# EAGLE design uNav4x4r1 (EAGLE 6.5.0)
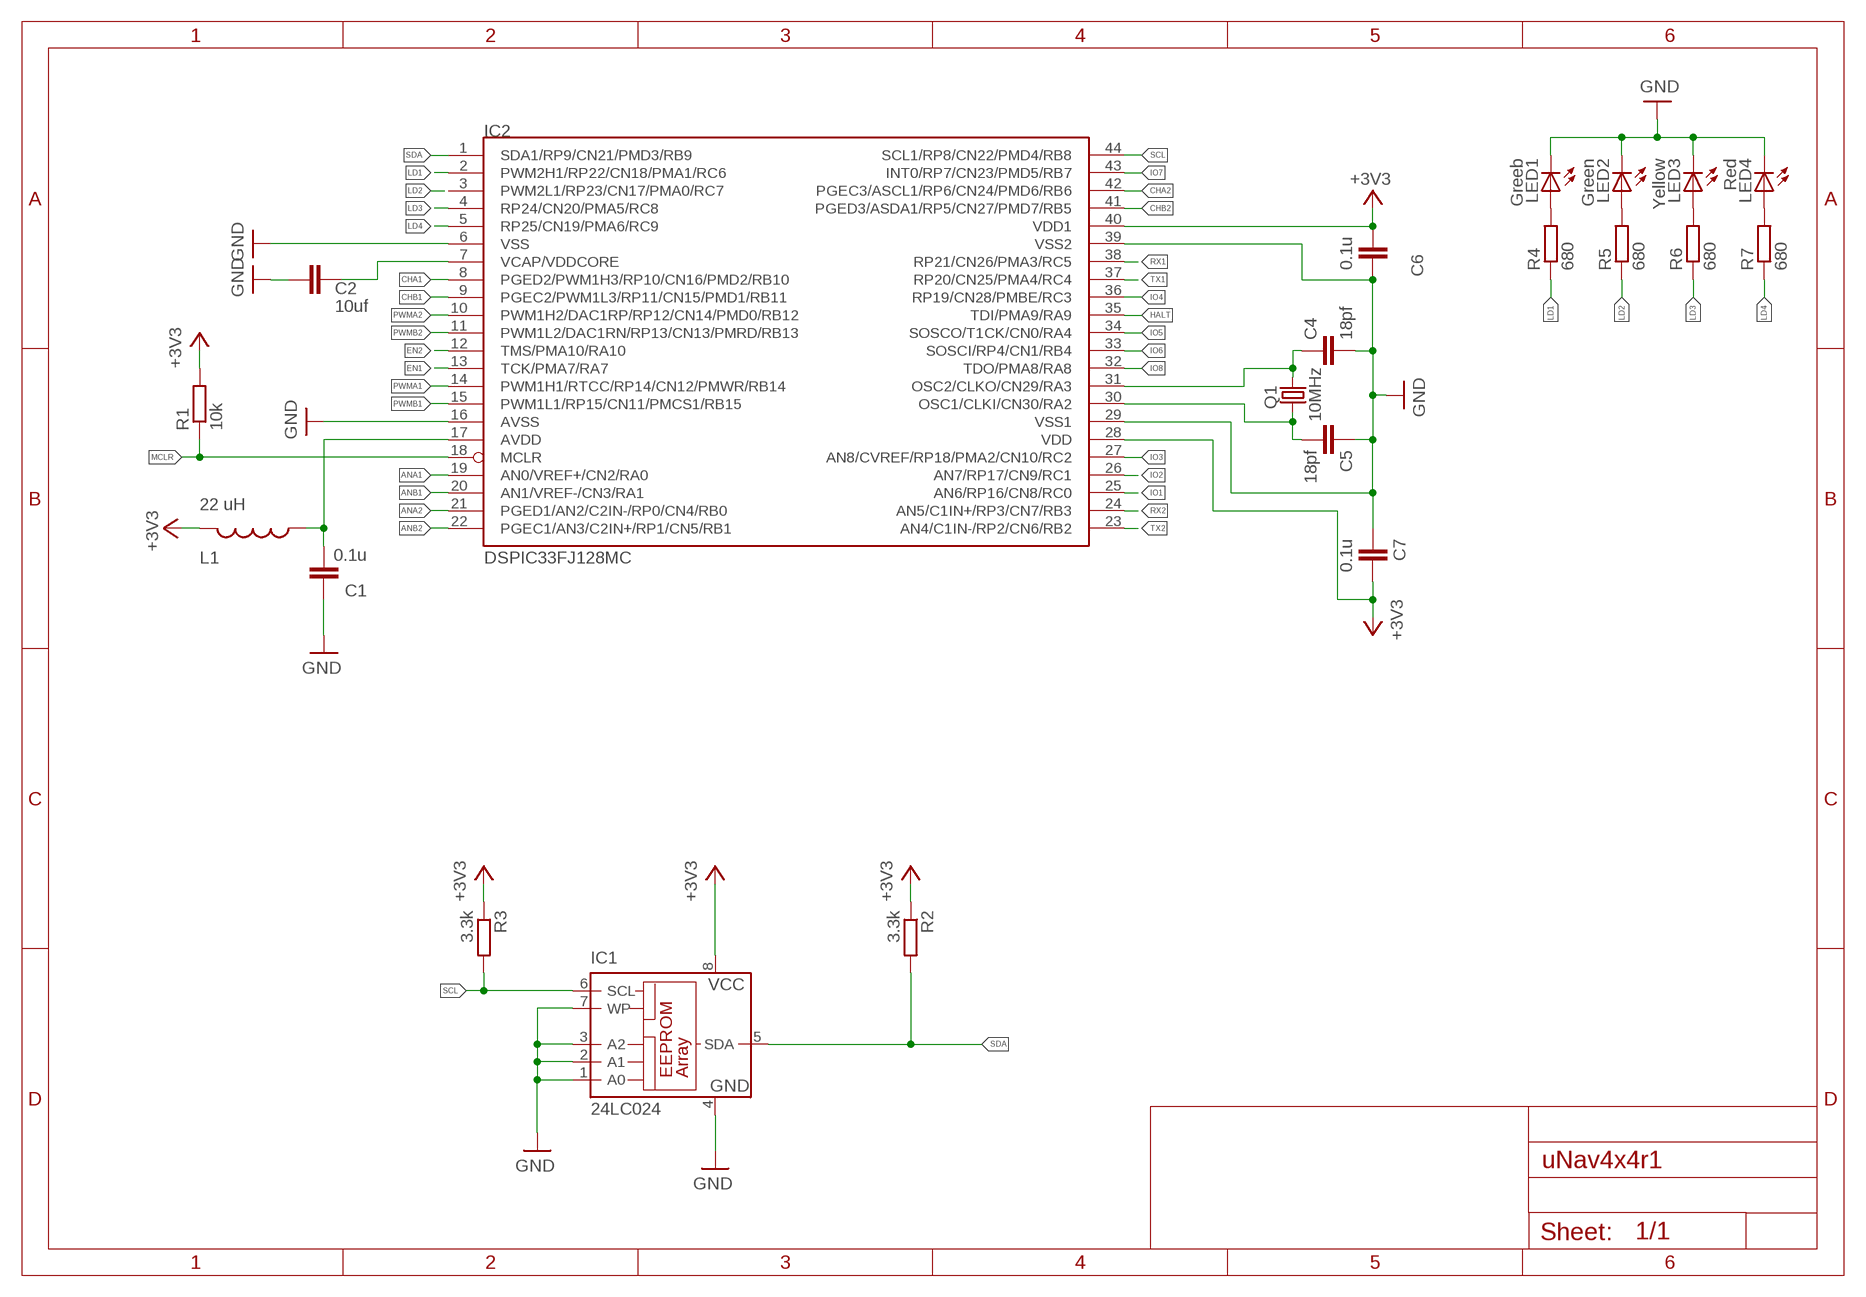
[diagram p0: schematic, sheet 1, part 1 of 2]
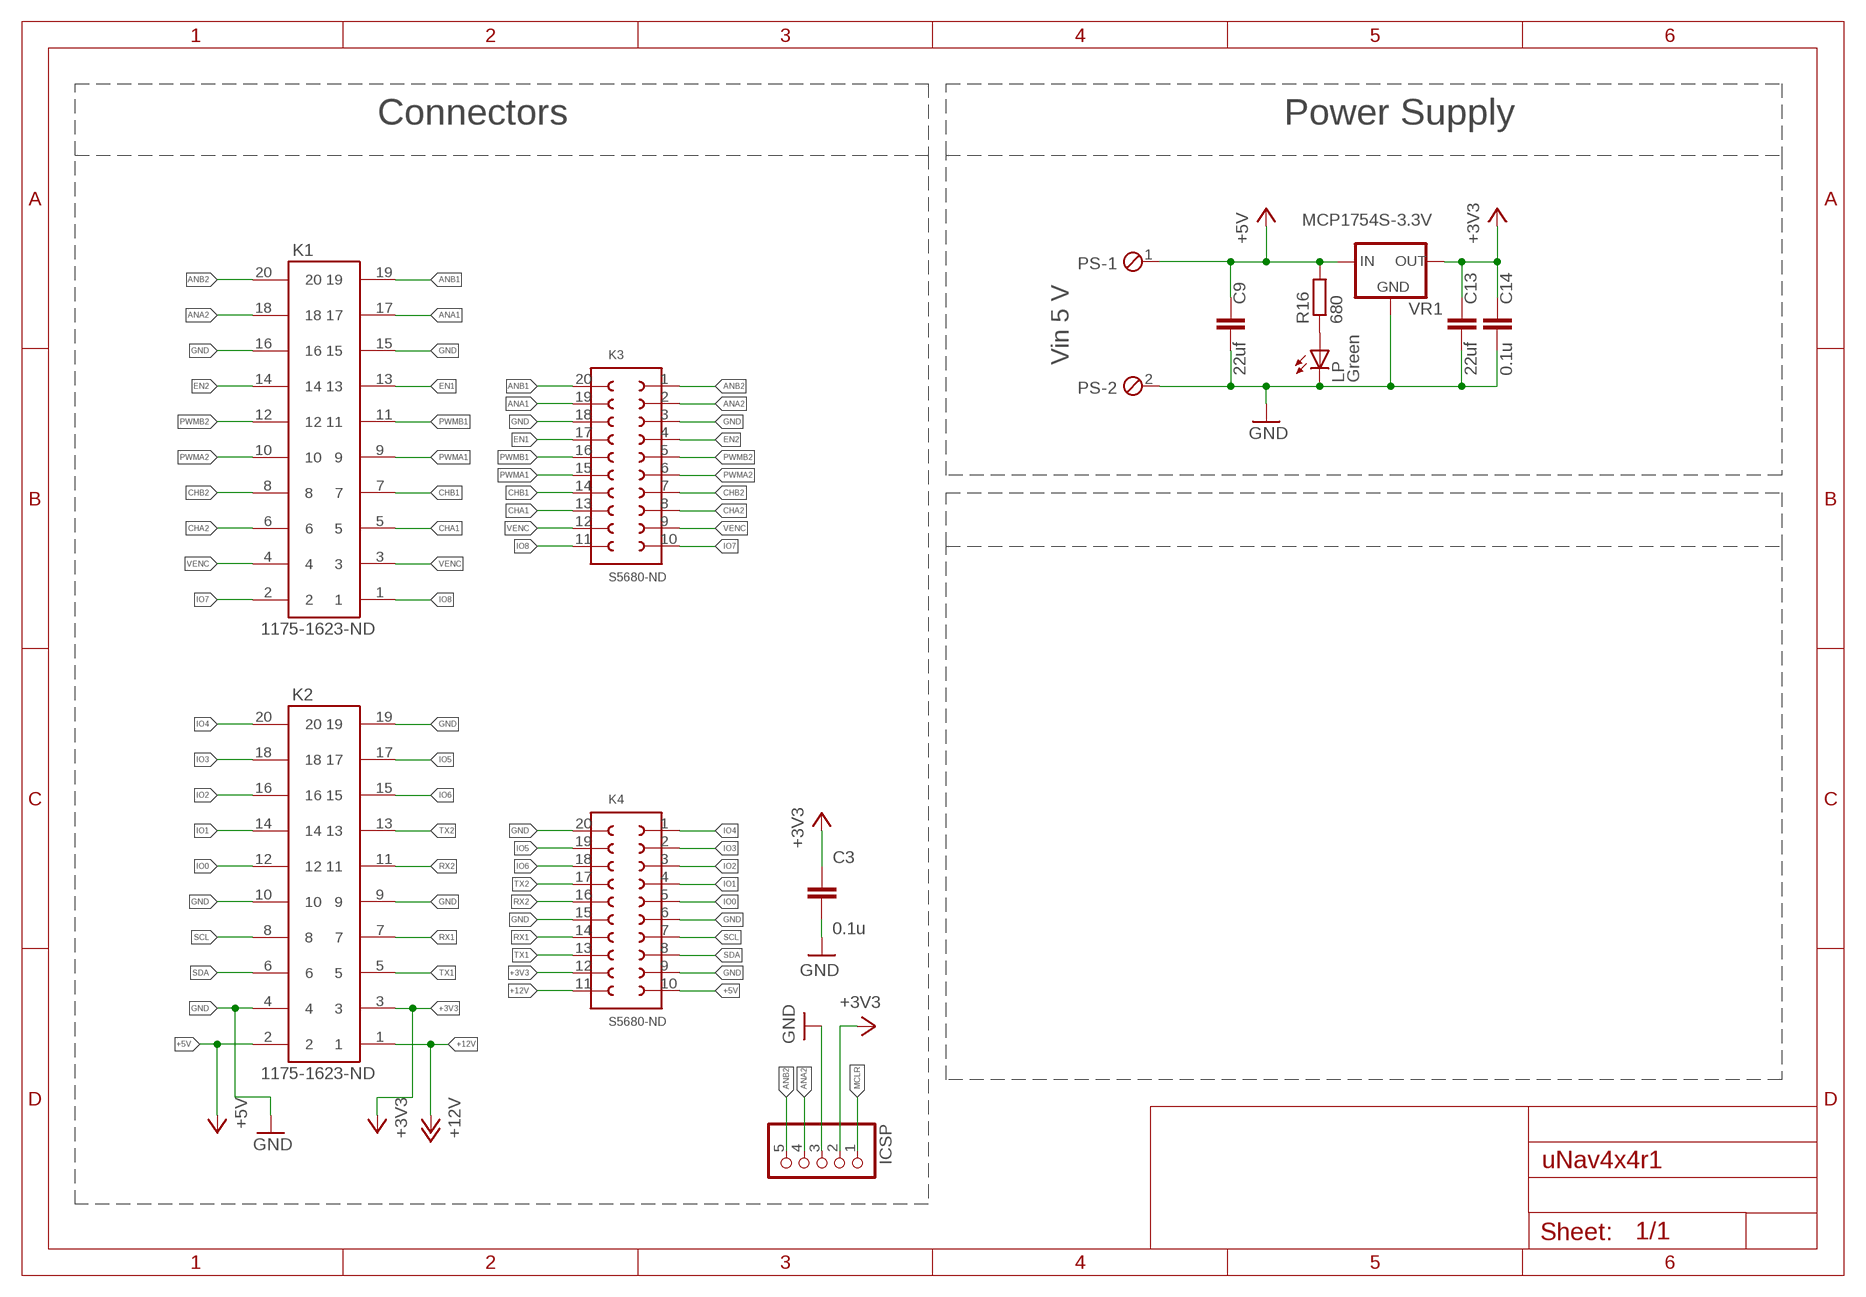
[diagram p1: schematic, sheet 1, part 2 of 2]

## Parts
C1  0.1u  C-EUC0603  [C0603]
C2  10uf  C-EUC1206  [C1206]
C3  0.1u  C-EUC0603  [C0603]
C4  18pf  C-EUC0603  [C0603]
C5  18pf  C-EUC0603  [C0603]
C6  0.1u  C-EUC0603  [C0603]
C7  0.1u  C-EUC0603  [C0603]
C9  22uf  C-EUC1206  [C1206]
C13  22uf  C-EUC1206  [C1206]
C14  0.1u  C-EUC0603  [C0603]
IC1  24LC024  24AA01SM  [SO-08M]
IC2  DSPIC33FJ128MC  DSPIC33FJ128MC804-PT  [TQFP44]
ICSP  PINHD-1X05_2.54-S  [1X05-S]
K1  1175-1623-ND  612X2020621  [612X2020621]
K2  1175-1623-ND  612X2020621  [612X2020621]
K3  S5680-ND  61002021821  [61002021821]
K4  S5680-ND  61002021821  [61002021821]
L1  22 uH  INDUCTOR0805  [0805]
LED1  Greeb  LEDCHIPLED_0805  [CHIPLED_0805]
LED2  Green  LEDCHIPLED_0805  [CHIPLED_0805]
LED3  Yellow  LEDCHIPLED_0805  [CHIPLED_0805]
LED4  Red  LEDCHIPLED_0805  [CHIPLED_0805]
LP  Green  LEDCHIPLED_0805  [CHIPLED_0805]
PS  MPT2  [2POL254]
Q1  10MHz  CRYSTALHC49U-V  [HC49U-V]
R1  10k  R-EU_R0603  [R0603]
R2  3.3k  R-EU_R0603  [R0603]
R3  3.3k  R-EU_R0603  [R0603]
R4  680  R-EU_R0603  [R0603]
R5  680  R-EU_R0603  [R0603]
R6  680  R-EU_R0603  [R0603]
R7  680  R-EU_R0603  [R0603]
R16  680  R-EU_R0603  [R0603]
VR1  MCP1754S-3.3V  MCP1754S  [SOT89]

## Nets
+3V3: C3.1 C6.2 C7.1 C13.1 C14.1 IC1.8(VCC) IC2.28(VDD) IC2.40(VDD1) ICSP.2 K2.3 K4.12 L1.2 R1.2 R2.1 R3.1 VR1.3(OUT)
+5V: C9.1 K2.2 K4.10 PS.1 R16.2 VR1.1(IN)
+12V: K2.1 K4.11
ANA1: IC2.19(AN0/VREF+/CN2/RA0) K1.17 K3.19
ANA2: IC2.21(PGED1/AN2/C2IN-/RP0/CN4/RB0) ICSP.4 K1.18 K3.2
ANB1: IC2.20(AN1/VREF-/CN3/RA1) K1.19 K3.20
ANB2: IC2.22(PGEC1/AN3/C2IN+/RP1/CN5/RB1) ICSP.5 K1.20 K3.1
AVDD: C1.2 IC2.17(AVDD) L1.1
CHA1: IC2.8(PGED2/PWM1H3/RP10/CN16/PMD2/RB10) K1.5 K3.13
CHA2: IC2.42(PGEC3/ASCL1/RP6/CN24/PMD6/RB6) K1.6 K3.8
CHB1: IC2.9(PGEC2/PWM1L3/RP11/CN15/PMD1/RB11) K1.7 K3.14
CHB2: IC2.41(PGED3/ASDA1/RP5/CN27/PMD7/RB5) K1.8 K3.7
EN1: IC2.13(TCK/PMA7/RA7) K1.13 K3.17
EN2: IC2.12(TMS/PMA10/RA10) K1.14 K3.4
GND: C1.1 C2.2 C3.2 C4.2 C5.1 C6.1 C7.2 C9.2 C13.2 C14.2 IC1.1(A0) IC1.2(A1) IC1.3(A2) IC1.4(GND) IC1.7(WP) IC2.6(VSS) IC2.16(AVSS) IC2.29(VSS1) IC2.39(VSS2) ICSP.3 K1.15 K1.16 K2.4 K2.9 K2.10 K2.19 K3.3 K3.18 K4.6 K4.9 K4.15 K4.20 LED1.C LED2.C LED3.C LED4.C LP.C PS.2 VR1.2(GND) VR1.4(GND)
HALT: IC2.35(TDI/PMA9/RA9)
IO0: K2.12 K4.5
IO1: IC2.25(AN6/RP16/CN8/RC0) K2.14 K4.4
IO2: IC2.26(AN7/RP17/CN9/RC1) K2.16 K4.3
IO3: IC2.27(AN8/CVREF/RP18/PMA2/CN10/RC2) K2.18 K4.2
IO4: IC2.36(RP19/CN28/PMBE/RC3) K2.20 K4.1
IO5: IC2.34(SOSCO/T1CK/CN0/RA4) K2.17 K4.19
IO6: IC2.33(SOSCI/RP4/CN1/RB4) K2.15 K4.18
IO7: IC2.43(INT0/RP7/CN23/PMD5/RB7) K1.2 K3.10
IO8: IC2.32(TDO/PMA8/RA8) K1.1 K3.11
LD1: IC2.2(PWM2H1/RP22/CN18/PMA1/RC6) R4.1
LD2: IC2.3(PWM2L1/RP23/CN17/PMA0/RC7) R5.1
LD3: IC2.4(RP24/CN20/PMA5/RC8) R6.1
LD4: IC2.5(RP25/CN19/PMA6/RC9) R7.1
MCLR: IC2.18(MCLR) ICSP.1 R1.1
N$2: C5.2 IC2.30(OSC1/CLKI/CN30/RA2) Q1.1
N$3: C4.1 IC2.31(OSC2/CLKO/CN29/RA3) Q1.2
N$5: LP.A R16.1
N$12: LED1.A R4.2
N$13: LED2.A R5.2
N$14: LED3.A R6.2
N$15: LED4.A R7.2
PWMA1: IC2.14(PWM1H1/RTCC/RP14/CN12/PMWR/RB14) K1.9 K3.15
PWMA2: IC2.10(PWM1H2/DAC1RP/RP12/CN14/PMD0/RB12) K1.10 K3.6
PWMB1: IC2.15(PWM1L1/RP15/CN11/PMCS1/RB15) K1.11 K3.16
PWMB2: IC2.11(PWM1L2/DAC1RN/RP13/CN13/PMRD/RB13) K1.12 K3.5
RX1: IC2.38(RP21/CN26/PMA3/RC5) K2.7 K4.14
RX2: IC2.24(AN5/C1IN+/RP3/CN7/RB3) K2.11 K4.16
SCL: IC1.6(SCL) IC2.44(SCL1/RP8/CN22/PMD4/RB8) K2.8 K4.7 R3.2
SDA: IC1.5(SDA) IC2.1(SDA1/RP9/CN21/PMD3/RB9) K2.6 K4.8 R2.2
TX1: IC2.37(RP20/CN25/PMA4/RC4) K2.5 K4.13
TX2: IC2.23(AN4/C1IN-/RP2/CN6/RB2) K2.13 K4.17
VCAP/VDDCORE: C2.1 IC2.7(VCAP/VDDCORE)
VENC: K1.3 K1.4 K3.9 K3.12

## Notes on the sheet
- Connectors | Power Supply
- Vin 5 V

## Library data of the parts
C1-C7 C9 C13 C14 = rcl:C-EU: CAPACITOR, European symbol
IC1 = microchip:24*: Serial EEPROM I2C; MF: MICROCHIP; MPN: 24AA01-I/SN; OC_FARNELL: 1331268; OC_NEWARK: 92C6793
IC2 = microchip-dspic33fjxxmc:DSPIC33FJ128MC804: dsPIC33FJ32MC302/304, dsPIC33FJ64MCX02/X04, AND dsPIC33FJ128MCX02/X04 High-Performance, 16-bit Digital Signal Controllers Package:44 Pin TQFP Operating Range: * Up to 40 MIPS operation (at 3.0V -3.6V): - Industrial temperature range (-40°C to +85°C) - Extended temperature range (-40°C to +125°C) High-Performance DSC CPU: * Modified Harvard architecture * C compiler optimized instruction set * 16-bit wide data path * 24-bit wide instructions * Linear program memory addressing up to 4M instruction words * Linear data memory addressing up to 64 Kbytes * 83 base instructions: mostly 1 word/1 cycle * Two 40-bit accumulators with rounding and saturation options * Flexible and powerful addressing modes: - Indirect - Modulo - Bit-Reversed * Software stack * 16 x 16 fractional/integer multiply operations * 32/16 and 16/16 divide operations * Single-cycle multiply and accumulate: - Accumulator write back for DSP operations - Dual data fetch * Up to ±16-bit shifts for up to 40-bit data Direct Memory Access (DMA): * 8-channel hardware DMA * Up to 2 Kbytes dual ported DMA buffer area (DMA RAM) to store data transferred via DMA: - Allows data transfer between RAM and a peripheral while CPU is executing code (no cycle stealing) * Most peripherals support DMA Timers/Capture/Compare/PWM: * Timer/Counters, up to five 16-bit timers: - Can pair up to make two 32-bit timers - One timer runs as a Real-Time Clock with an external 32.768 kHz oscillator - Programmable prescaler * Input Capture (up to four channels): - Capture on up, down or both edges - 16-bit capture input functions - 4-deep FIFO on each capture * Output Compare (up to four channels): - Single or Dual 16-bit Compare mode - 16-bit Glitchless PWM mode * Hardware Real-Time Clock/Calendar (RTCC): - Provides clock, calendar, and alarm functions Interrupt Controller: * 5-cycle latency * Up to 53 available interrupt sources * Up to three external interrupts * Seven programmable priority levels * Five processor exceptions Digital I/O: * Peripheral pin Select functionality * Up to 35 programmable digital I/O pins * Wake-up/Interrupt-on-Change for up to 31 pins * Output pins can drive from 3.0V to 3.6V * Up to 5V output with open drain configuration * All digital input pins are 5V tolerant * 4 mA sink on all I/O pins On-Chip Flash and SRAM: * Flash program memory (up to 128 Kbytes) * Data SRAM (up to 16 Kbytes) * Boot, Secure, and General Security for program Flash System Management: * Flexible clock options: - External, crystal, resonator, internal RC - Fully integrated Phase-Locked Loop (PLL) - Extremely low jitter PLL * Power-up Timer * Oscillator Start-up Timer/Stabilizer * Watchdog Timer with its own RC oscillator * Fail-Safe Clock Monitor * Reset by multiple sources Power Management: * On-chip 2.5V voltage regulator * Switch between clock sources in real time * Idle, Sleep, and Doze modes with fast wake-up Analog-to-Digital Converters (ADCs): * 10-bit, 1.1 Msps or 12-bit, 500 Ksps conversion: - Two and four simultaneous samples (10-bit ADC) - Up to nine input channels with auto-scanning - Conversion start can be manual or synchronized with one of four trigger sources - Conversion possible in Sleep mode - ±2 LSb max integral nonlinearity - ±1 LSb max differential nonlinearity Audio Digital-to-Analog Converter (DAC): - 16-bit Dual Channel DAC module - 100 Ksps maximum sampling rate - Second-Order Digital Delta-Sigma Modulator Comparator Module: * Two analog comparators with programmable input/output configuration CMOS Flash Technology: * Low-power, high-speed Flash technology * Fully static design * 3.3V (±10%) operating voltage * Industrial and Extended temperature * Low power consumption Motor Control Peripherals: * 6-channel 16-bit Motor Control PWM: - Three duty cycle generators - Independent or Complementary mode - Programmable dead-time and output polarity - Edge-aligned or center-aligned - Manual output override control - One Fault input - Trigger for ADC conversions - PWM frequency for 16-bit resolution (@ 40 MIPS) = 1220 Hz for Edge-Aligned mode, 610 Hz for Center-Aligned mode - PWM frequency for 11-bit resolution (@ 40 MIPS) = 39.1 kHz for Edge-Aligned mode, 19.55 kHz for Center-Aligned mode * 2-channel 16-bit Motor Control PWM: - One duty cycle generator - Independent or Complementary mode - Programmable dead time and output polarity - Edge-aligned or center-aligned - Manual output override control - One Fault input - Trigger for ADC conversions - PWM frequency for 16-bit resolution (@ 40 MIPS) = 1220 Hz for Edge-Aligned mode, 610 Hz for Center-Aligned mode - PWM frequency for 11-bit resolution (@ 40 MIPS) = 39.1 kHz for Edge-Aligned mode, 19.55 kHz for Center-Aligned mode * 2-Quadrature Encoder Interface module: - Phase A, Phase B, and index pulse input - 16-bit up/down position counter - Count direction status - Position Measurement (x2 and x4) mode - Programmable digital noise filters on inputs - Alternate 16-bit Timer/Counter mode - Interrupt on position counter rollover/underflow
ICSP = pinhead-2:PINHD-1X05: PIN HEADER
K1 K2 = Wuerth_Elektronik_eiCan_Wire_to_Board_Connectors:612X2020621: WR-BHD 2.54mm Male SMT Box Header High Temperature, 20 Pins=>Code : Con_WTB_BHD_2.54_Male_SMT_612X2020621 <http://katalog.we-online.de/media/thumbs2/eican/thb_Con_WTB_BHD_2.54_Male_SMT_6120xx20621_pf2.jpg> Details see: http://katalog.we-online.de/en/em/612_0xx_206_21 Created 2014-06-05, Karrer Zheng 2014 (C) Würth Elektronik
K3 K4 = Wuerth_Elektronik_eiCan_Board_to_Board_Connectors:61002021821: WR-PHD 2.54mm Dual SMT Socket Header, 20 Pins=>Code : Con_BTB_SHD_2.54_1_SMT_61002021821 <http://katalog.we-online.de/media/images/eican/Con_BTB_SHD_2.54_1_SMT_6100xx21821_pf2.jpg> Details see: http://katalog.we-online.de/en/em/610_0xx_218_21 Created 2014-05-30, Karrer Zheng 2014 (C) Würth Elektronik
L1 = SparkFun-Passives:INDUCTOR: Inductors Basic Inductor/Choke - 0603 and 1206. Footprints are not proven and vary greatly between part numbers. SRN6045- 33uH, 20% 1.4A SDR0403-560KL - 56uH, 10%, 500mA RMS/740mA peak
LED1-LED4 LP = led:LED: LED OSRAM: - CHIPLED LG R971, LG N971, LY N971, LG Q971, LY Q971, LO R971, LY R971 LH N974, LH R974 LS Q976, LO Q976, LY Q976 LO Q996 - Hyper CHIPLED LW Q18S LB Q993, LB Q99A, LB R99A - SideLED LS A670, LO A670, LY A670, LG A670, LP A670 LB A673, LV A673, LT A673, LW A673 LH A674 LY A675 LS A676, LA A676, LO A676, LY A676, LW A676 LS A679, LY A679, LG A679 - Hyper Micro SIDELED® LS Y876, LA Y876, LO Y876, LY Y876 LT Y87S - SmartLED LW L88C, LW L88S LB L89C, LB L89S, LG L890 LS L89K, LO L89K, LY L89K LS L896, LA L896, LO L896, LY L896 - TOPLED LS T670, LO T670, LY T670, LG T670, LP T670 LSG T670, LSP T670, LSY T670, LOP T670, LYG T670 LG T671, LOG T671, LSG T671 LB T673, LV T673, LT T673, LW T673 LH T674 LS T676, LA T676, LO T676, LY T676, LB T676, LH T676, LSB T676, LW T676 LB T67C, LV T67C, LT T67C, LS T67K, LO T67K, LY T67K, LW E67C LS E67B, LA E67B, LO E67B, LY E67B, LB E67C, LV E67C, LT E67C LW T67C LS T679, LY T679, LG T679 LS T770, LO T770, LY T770, LG T770, LP T770 LB T773, LV T773, LT T773, LW T773 LH T774 LS E675, LA E675, LY E675, LS T675 LS T776, LA T776, LO T776, LY T776, LB T776 LHGB T686 LT T68C, LB T68C - Hyper Mini TOPLED® LB M676 - Mini TOPLED Santana® LG M470 LS M47K, LO M47K, LY M47K Source: http://www.osram.convergy.de LUXEON: - LUMILED® LXK2-PW12-R00, LXK2-PW12-S00, LXK2-PW14-U00, LXK2-PW14-V00 LXK2-PM12-R00, LXK2-PM12-S00, LXK2-PM14-U00 LXK2-PE12-Q00, LXK2-PE12-R00, LXK2-PE12-S00, LXK2-PE14-T00, LXK2-PE14-U00 LXK2-PB12-K00, LXK2-PB12-L00, LXK2-PB12-M00, LXK2-PB14-N00, LXK2-PB14-P00, LXK2-PB14-Q00 LXK2-PR12-L00, LXK2-PR12-M00, LXK2-PR14-Q00, LXK2-PR14-R00 LXK2-PD12-Q00, LXK2-PD12-R00, LXK2-PD12-S00 LXK2-PH12-R00, LXK2-PH12-S00 LXK2-PL12-P00, LXK2-PL12-Q00, LXK2-PL12-R00 Source: www.luxeon.com KINGBRIGHT: KA-3528ASYC Source: www.kingbright.com
PS = Personale:MPT2: PHOENIX CONNECTOR
Q1 = crystal:CRYSTAL: CRYSTAL; OC_FARNELL: 1666969; OC_NEWARK: unknown
R1-R7 R16 = rcl:R-EU_: RESISTOR, European symbol
VR1 = Personale:MCP1754S

## Net classes
0 default: width 0.203 mm, clearance 0.203 mm
1 power: width 0.305 mm, clearance 0.203 mm

## Board
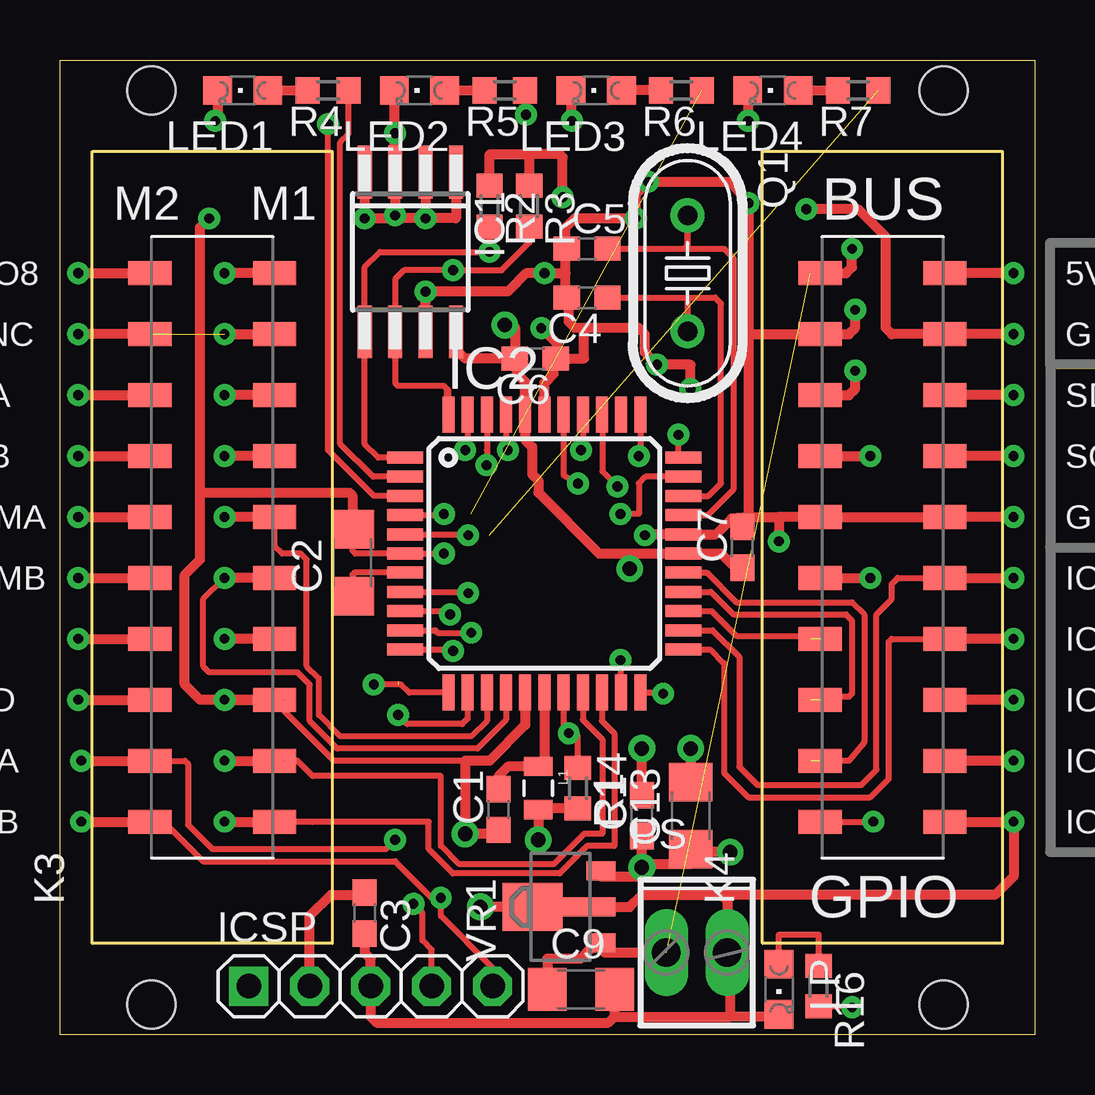
[diagram p2: board, top side]
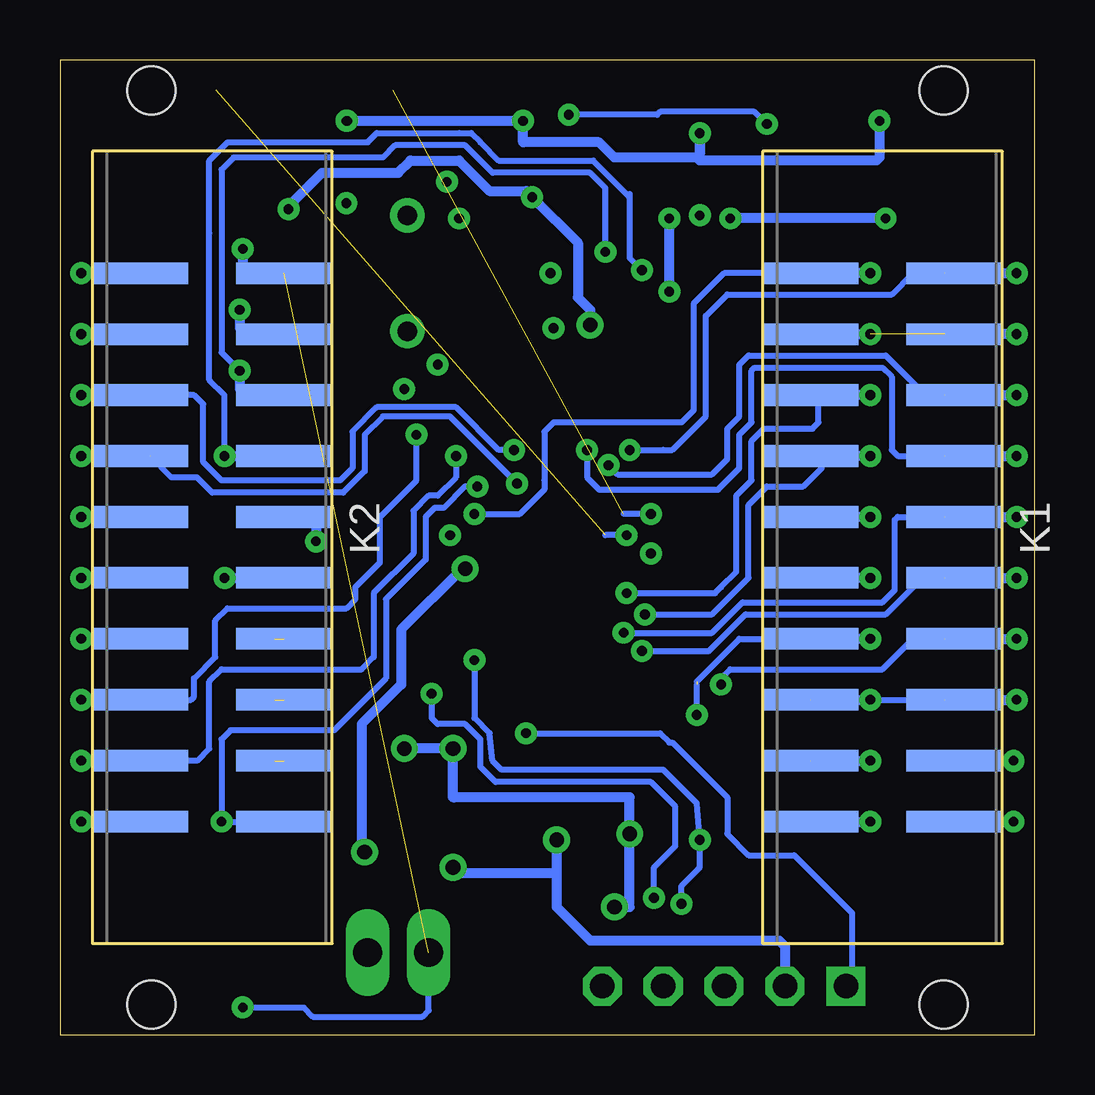
[diagram p3: board, bottom side, seen from below]

Size 40.64 x 40.64 mm. Coordinates in mm from the lower left corner, seen from the top.
Outline: 40.64,40.64 40.64,0 0,0 0,40.64 40.64,40.64
Copper layers (1*16): Top 0.035mm / dielectric 1.5mm / Bottom 0.035mm
Design rules "default": minimum track width 8mil, minimum drill 20mil, track to track 8mil, track to pad 8mil, pad to pad 8mil, via to via 8mil, smd to smd 8mil, copper to edge 10mil, drill to drill 8mil, minimum pad ring 12mil, minimum via ring 10mil, stop-mask expansion 4mil, vias tented up to drill 20mil, thermal gap 10mil
Holes 2 mm at 3.81,39.37 36.83,1.27 36.83,39.37 3.81,1.27
tRestrict: area -0.3,-1.9 to 42.9,0.6; area -0.3,41.9 to 42.9,44.5; area -1.9,0 to 0.6,43.2; area 41.6,0 to 44.1,43.2
bRestrict: area -1.9,0 to 0.6,43.2; area 41.6,0 to 44.1,43.2; area -0.3,-1.9 to 42.9,0.6; area -0.3,41.9 to 42.9,44.5

### Footprints (pad centres in the part's own frame; a part is rotated, then mirrored left to right if it is on the bottom)
C0603 = smd 1.1 x 1: 1 -0.85,0; 2 0.85,0
C1206 = smd 1.6 x 1.8: 1 -1.4,0; 2 1.4,0
SO-08M = smd 0.6 x 2.2: 1 -1.905,-3.33; 2 -0.635,-3.33; 3 0.635,-3.33; 4 1.905,-3.33; 5 1.905,3.33; 6 0.635,3.33; 7 -0.635,3.33; 8 -1.905,3.33
TQFP44 = smd 1.5 x 0.5: 1 -5.8,4; 2 -5.8,3.2; 3 -5.8,2.4; 4 -5.8,1.6; 5 -5.8,0.8; 6 -5.8,0; 7 -5.8,-0.8; 8 -5.8,-1.6; 9 -5.8,-2.4; 10 -5.8,-3.2; 11 -5.8,-4; 23 5.8,-4; 24 5.8,-3.2; 25 5.8,-2.4; 26 5.8,-1.6; 27 5.8,-0.8; 28 5.8,0; 29 5.8,0.8; 30 5.8,1.6; 31 5.8,2.4; 32 5.8,3.2; 33 5.8,4 | smd 0.5 x 1.5: 12 -4,-5.8; 13 -3.2,-5.8; 14 -2.4,-5.8; 15 -1.6,-5.8; 16 -0.8,-5.8; 17 0,-5.8; 18 0.8,-5.8; 19 1.6,-5.8; 20 2.4,-5.8; 21 3.2,-5.8; 22 4,-5.8; 34 4,5.8; 35 3.2,5.8; 36 2.4,5.8; 37 1.6,5.8; 38 0.8,5.8; 39 0,5.8; 40 -0.8,5.8; 41 -1.6,5.8; 42 -2.4,5.8; 43 -3.2,5.8; 44 -4,5.8
1X05-S = drill 1.016 square: 1 -5.08,0 | drill 1.016 octagon: 2 -2.54,0; 3 0,0; 4 2.54,0; 5 5.08,0
612X2020621 = smd 0.9 x 4: 1 0,-3; 2 0,3; 3 2.54,-3; 4 2.54,3; 5 5.08,-3; 6 5.08,3; 7 7.62,-3; 8 7.62,3; 9 10.16,-3; 10 10.16,3; 11 12.7,-3; 12 12.7,3; 13 15.24,-3; 14 15.24,3; 15 17.78,-3; 16 17.78,3; 17 20.32,-3; 18 20.32,3; 19 22.86,-3; 20 22.86,3
61002021821 = smd 1 x 1.8: 1 -11.43,2.6; 2 -8.89,2.6; 3 -6.35,2.6; 4 -3.81,2.6; 5 -1.27,2.6; 6 1.27,2.6; 7 3.81,2.6; 8 6.35,2.6; 9 8.89,2.6; 10 11.43,2.6; 11 11.43,-2.6; 12 8.89,-2.6; 13 6.35,-2.6; 14 3.81,-2.6; 15 1.27,-2.6; 16 -1.27,-2.6; 17 -3.81,-2.6; 18 -6.35,-2.6; 19 -8.89,-2.6; 20 -11.43,-2.6
0805 = smd 0.8 x 1.2: 1 -0.9,0; 2 0.9,0
CHIPLED_0805 = smd 1.2 x 1.2: A 0,-1.05; C 0,1.05
2POL254 = drill 1.2 long: 1 -1.27,0; 2 1.27,0
HC49U-V = drill 0.813: 1 -2.413,0; 2 2.413,0
R0603 = smd 1 x 1.1: 1 -0.85,0; 2 0.85,0
SOT89 = smd 0.8 x 1.2: 1 -1.5,-1.6; 3 1.5,-1.6 | smd 0.8 x 2.3: 2 0,-1.05 | smd 2 x 2.5: 4 0,1.25

### Placement (x,y rotation side)
C1  18.29,9.4 90 top
C2  12.19,19.68 90 top
C3  12.7,5.08 270 top
C4  21.97,30.73 180 top
C5  21.97,32.77 0 top
C6  19.81,28.19 180 top
C7  28.45,20.32 90 top
C9  21.72,1.91 0 top
C13  26.29,9.14 90 top
C14  24.26,9.14 90 top
IC1  14.61,32.64 180 top
IC2  20.19,20.07 0 top
ICSP  12.95,2.03 0 top
K1  6.35,31.75 270 bottom
K2  34.29,31.75 270 bottom
K3  6.35,20.32 90 top
K4  34.29,20.32 90 top
L1  19.94,10.29 270 top
LED1  7.62,39.37 90 top
LED2  14.99,39.37 90 top
LED3  22.35,39.37 90 top
LED4  29.72,39.37 90 top
LP  29.97,1.91 180 top
PS  26.54,3.43 0 top
Q1  26.16,31.75 270 top
R1  21.59,10.29 270 top
R2  17.91,34.54 270 top
R3  19.56,34.54 270 top
R4  11.18,39.37 180 top
R5  18.54,39.37 180 top
R6  25.91,39.37 180 top
R7  33.27,39.37 180 top
R16  31.62,2.03 270 top
VR1  20.95,5.33 90 top

### Tracks (layer width: path | path; a pad name or v marks a point on that pad's centre or on a via)
+3V3  (via drill 0.41, 0.61)
  Top 0.254: R2.1 17.95,35.43
  Top 0.406: C6.2 19.05,28.11 19.05,27.56 19.39,27.22 IC2.40 19.39,24.8 19.68,24.51 19.68,23.37 19.94,23.11 19.94,22.61 22.48,20.07 23.75,20.07 | C7.1 28.16,19.47 27.56,20.07 IC2.28 23.75,20.07 | v39.75,29.21 K4.12 34.67,29.21 34.42,29.46 34.42,33.27 33.27,34.42 v31.11,34.42 | C6.2 16.89,28.19 16.51,28.57 IC1.8 | 24.26,7.11 26.29,7.11 C13.1 26.41,7.62 v27.94,7.62 | 24.26,7.11 C14.1 v24.26,6.99 | VR1.3 22.55,6.6 24.26,6.6 v24.26,6.99 | v24.26,6.99 24.26,7.11 | R2.1 17.91,36.7 19.56,36.7 | 19.56,36.7 R3.1 | R1.2 19.99,9.44 L1.2 v19.94,8.13 | ICSP.2 10.41,4.95 11.3,5.84 12.61,5.84 C3.1 | v20.95,34.92 20.95,36.58 20.83,36.7 19.56,36.7 | v18.54,29.59 18.96,29.5 C6.2 | 23.75,20.07 v23.75,19.43
  Bottom 0.406: K2.3 v39.75,29.21 | v19.94,8.13 19.94,6.86 | 19.94,6.86 20.07,6.73 24,6.73 v24.26,6.99 | v18.54,29.59 18.54,30.23 19.05,30.73 19.05,33.02 v20.95,34.92 21.21,35.18 22.73,35.18 24,36.45 26.04,36.45 26.54,35.94 29.72,35.94 31.11,34.54 v31.11,34.42 | 19.94,6.86 19.94,5.33 18.54,3.94 10.67,3.94 10.41,3.68 ICSP.2 | v23.75,19.43 23.88,19.43 26.42,16.89 26.42,14.61 28.07,12.95 28.07,7.75 v27.94,7.62
+5V  (via drill 0.41)  (1 unrouted)
  Top 0.254: R16.2 32.98,1.18 v33.02,1.14
  Top 0.406: K4.10 32.77,31.75 33.02,32 v33.02,32.77 | C9.1 20.32,1.53 20.32,3.17 21.72,3.17 22.12,3.58 VR1.1 22.71,3.43 PS.1
  Bottom 0.254: v33.02,1.14 30.48,1.14 30.1,0.76 25.53,0.76 25.27,1.02 PS.1
  Bottom 0.406: v33.02,32.77 33.02,32 32.77,31.75 K2.2
+12V  (via drill 0.41)
  Top 0.406: v39.75,31.75 K4.11
  Bottom 0.406: K2.1 v39.75,31.75
ANA1  (via drill 0.41)  (1 unrouted)
  Top 0.254: IC2.19 21.79,13.13 22.61,12.32 22.61,8.38 21.84,8.38 20.57,7.11 16.64,7.11 15.88,7.87 15.88,10.79 10.54,10.79 9.91,11.43 K1.17 | 9.27,11.43 9.02,11.43
  Top 0.406: v6.86,11.43 K3.19 | 9.27,11.43 K1.17
  Bottom 0.406: K1.17 v6.86,11.43
ANA2  (via drill 0.41)
  Top 0.254: IC2.21 23.39,15.6 v23.37,15.62 | K3.2 5.21,11.43 5.33,11.3 5.33,8.76 6.35,7.75 13.59,7.75 v13.97,8.13 | ICSP.4 15.49,3.56 15.11,3.94 15.11,5.08 v14.73,5.46
  Top 0.406: v0.89,11.43 K3.2
  Bottom 0.254: v23.37,15.62 23.37,13.21 22.73,12.57 22.61,11.43 22.23,11.05 15.49,11.05 14.1,9.65 v13.97,8.13 13.97,6.99 14.73,6.22 v14.73,5.46
  Bottom 0.406: K1.18 v0.89,11.43
ANB1  (via drill 0.41)
  Top 0.254: IC2.20 22.59,13.09 23.11,12.57 23.11,7.87 21.97,7.87 20.83,6.73 16.38,6.73 15.37,7.75 15.37,8.89 10.54,8.89 | 10.53,8.88 10.54,8.89 | 10.54,8.89 K3.20
  Top 0.406: v6.86,8.89 K3.20
  Bottom 0.406: K1.19 v6.86,8.89
ANB2  (via drill 0.41)
  Top 0.254: IC2.22 25.1,14.27 v25.15,14.22 | K3.1 4.32,8.89 5.97,7.24 13.97,7.24 15.49,5.71 v15.88,5.71 15.88,4.95 18.03,2.79 ICSP.5
  Top 0.406: v0.89,8.89 K3.1
  Bottom 0.254: v25.15,14.22 25.15,13.21 24.89,12.95 23.75,12.95 23.11,12.32 23.11,11.18 22.48,10.54 16,10.54 14.99,9.53 14.99,7.87 15.88,6.99 v15.88,5.71
  Bottom 0.406: K1.20 v0.89,8.89
AVDD
  Top 0.406: IC2.17 20.19,11.44 L1.1 18.68,11.19 18.29,10.79 C1.2
CHA1  (via drill 0.41)
  Top 0.254: IC2.8 16.94,18.47 v17.02,18.41
  Top 0.406: K3.13 v6.86,26.67
  Bottom 0.254: v17.02,18.41 13.34,18.41 13.08,18.67 12.45,19.3 12.45,22.48 11.81,23.11 11.81,24.77 11.3,25.27 9.27,25.27 9.02,25.53 9.02,26.67 | 9.14,26.67 9.14,26.8
  Bottom 0.406: v6.86,26.67 9.02,26.67 9.14,26.67 K1.5
CHA2  (via drill 0.41)  (1 unrouted)
  Top 0.254: IC2.42 17.79,24.37 v17.78,23.75
  Top 0.406: v0.76,26.67 K3.8
  Bottom 0.254: v17.78,23.75 17.4,23.37 13.46,23.37 12.83,24 12.83,25.27 12.32,25.78 12.32,27.94 11.94,28.32 6.22,28.32 4.45,26.54 3.88,26.54 K3.8
  Bottom 0.406: K1.6 v0.76,26.67
CHB1  (via drill 0.41)
  Top 0.254: IC2.9 16.12,17.67 v16.26,17.53
  Top 0.406: K3.14 v6.86,24.13
  Bottom 0.254: v16.26,17.53 13.46,17.53 11.94,19.05 11.94,22.1 11.18,22.86 9.65,22.86 8.89,23.62 8.89,24.13 K1.7 9.4,24.13
  Bottom 0.406: v6.86,24.13 K1.7
CHB2  (via drill 0.41)  (1 unrouted)
  Top 0.254: IC2.41 18.59,24.46 v18.67,24.38
  Top 0.406: v0.76,24.13 K3.7
  Bottom 0.254: v18.67,24.38 18.67,23.24 18.16,22.73 13.21,22.73 12.45,23.5 12.32,23.62 12.32,25.02 11.81,25.53 11.81,27.69 11.68,27.81 6.35,27.81 5.97,27.43 5.97,24.38 5.71,24.13 K3.7
  Bottom 0.406: K1.8 v0.76,24.13
EN1  (via drill 0.41)  (1 unrouted)
  Top 0.254: IC2.13 16.99,13.18 16.76,12.95 14.48,12.95 v14.1,13.34
  Top 0.406: K3.17 v6.86,16.51
  Bottom 0.254: v14.1,13.34 14.1,14.61 | 14.1,14.73 12.32,16.51 K1.13
  Bottom 0.406: v6.86,16.51 K1.13
EN2  (via drill 0.41)  (1 unrouted)
  Top 0.254: IC2.12 14.56,14.27 14.22,14.61 v13.08,14.61
  Top 0.406: v0.76,16.51 K3.4
  Bottom 0.254: v13.08,14.61 13.08,14.86 12.7,15.24 6.35,15.24 5.08,16.51
  Bottom 0.406: K1.14 v0.76,16.51 | 5.08,16.51 K3.4
GND  (via drill 0.41, 0.61)  (2 unrouted)
  Top 0.254: C5.1 21.08,32.77 | 21.08,31.11 C4.2 | 16.89,11.43 11.43,11.43 9.35,13.51 K1.15 | v16,20.07 IC2.6 12.32,20.07 12.19,20.19 C2.2
  Top 0.406: v0.76,13.97 K3.3 | v6.86,13.97 K3.18 8.26,13.97 | v26.29,26.92 26.29,27.94 v24.89,27.94 24.38,28.45 24.38,29.21 24.13,29.46 21.84,29.46 | 21.84,29.46 21.46,29.46 21.21,29.72 21.21,30.99 21.08,31.11 21.08,31.75 | 21.08,31.75 21.08,32.77 21.08,33.66 21.46,34.04 v24,34.04 24,35.05 v24.51,35.56 27.94,35.56 v28.7,34.67 28.7,29.21 | v13.97,34.16 IC1.3 13.94,36 13.94,38.1 | v13.97,34.16 13.97,34.04 | 13.97,34.04 14.1,34.04 | IC1.1 16.51,34.04 v15.24,34.04 15.11,34.04 | IC1.2 15.24,34.16 15.11,34.04 | IC1.4 v12.7,34.04 13.97,34.04 | LED1.C 6.57,38.35 v6.48,38.1 | LED2.C 13.94,38.1 | 13.94,38.1 v13.97,37.59 | LED3.C 21.3,38.1 v21.34,38.1 | LED4.C v28.67,38.1 v28.7,38.1 | 28.7,29.21 28.7,21.59 | 28.7,21.59 28,21.53 | 28,21.53 27.34,20.87 IC2.29 24.42,20.87 v24.38,20.83 | 21.08,31.75 v20.19,31.75 19.43,31.75 18.67,30.99 v15.24,30.99 IC1.7 | IC2.39 20.19,27.18 20.57,27.56 20.57,28.11 C6.1 | C6.1 21.84,28.19 21.84,29.46 | C7.2 28.47,21.53 28,21.53 | 28.7,21.59 29.97,21.59 | 29.97,21.59 K4.6 K4.15 v39.75,21.59 | 29.97,21.59 v29.97,20.57 | IC2.16 19.39,12.92 17.91,11.43 16.89,11.43 v16.89,8.38 17.78,8.38 C1.1 | v33.15,30.23 33.15,29.46 32.89,29.21 K4.9 28.7,29.21 | C14.2 v24.26,11.94 | v26.29,11.94 C13.2 | 22.1,5.33 VR1.4 | VR1.4 VR1.2 21.88,5.37 21.97,5.21 22.1,5.33 | VR1.4 v17.53,5.33 | C9.2 23.12,0.76 | 23.12,0.76 27.94,0.76 | 27.94,0.76 27.94,3.43 PS.2 27.81,5.59 27.56,5.84 | LP.C 29.97,0.76 27.94,0.76 | 22.1,5.33 23.75,5.33 24.26,5.84 27.56,5.84 | 15.11,34.04 14.1,34.04 | 14.1,34.04 v13.97,34.16 | K1.15 5.84,13.97 5.21,14.61 5.21,19.18 5.84,19.81 5.84,22.48 | 5.84,22.48 5.97,22.61 12.06,22.61 12.19,22.48 C2.2
  Top 0.406: 5.84,22.48 5.84,33.66 v6.22,34.04 | v20.07,29.46 20.7,28.83 20.7,28.23 C6.1 | C3.2 12.7,3.43 12.95,3.17 ICSP.3 12.95,0.76 13.21,0.51 22.86,0.51 23.12,0.76 | K4.20 v39.75,8.89 39.75,6.6 38.99,5.84 27.56,5.84
  Bottom 0.254: v6.86,13.97 K3.3
  Bottom 0.406: K1.16 v0.76,13.97 | K1.15 v6.86,13.97 | K2.10 29.97,21.59 v29.97,20.57 | K2.19 v39.75,8.89 | K2.9 v39.75,21.59 | v33.15,30.23 33.15,29.46 32.89,29.21 K2.4 30.1,29.21 | v26.29,11.94 v24.26,11.94 C14.2 24.17,9.91 | 24.17,9.91 16.89,9.91 v16.89,8.38 16.89,5.33 v17.53,5.33 | 24.26,9.91 24.17,9.91 | v15.24,30.99 v15.24,34.04 | v6.22,34.04 v12.7,34.04 | v6.48,38.1 6.48,36.58 6.6,36.45 13.97,36.45 v13.97,37.59 13.97,36.7 14.1,36.58 17.53,36.58 18.16,37.21 21.34,37.21 v21.34,38.1 v28.67,38.1
IO0  (via drill 0.41)
  Top 0.406: K4.5 v33.78,19.05
  Bottom 0.406: v33.78,19.05 K2.12
IO1  (2 unrouted)
  Top 0.254: IC2.25 27.16,17.67 28.19,16.64 31.16,16.64 K2.14
IO2  (1 unrouted)
  Top 0.254: IC2.26 27.13,18.47 28.07,17.53 32.77,17.53 33.02,17.27 33.02,14.22 32.89,14.1 31.82,14.1 K4.3
IO3  (1 unrouted)
  Top 0.254: IC2.27 26.96,19.27 28.19,18.03 33.02,18.03 33.53,17.53 33.53,12.19 32.89,11.43 K4.2
IO4  (via drill 0.41)
  Top 0.254: IC2.36 22.61,25.85 22.61,23.5 v23.24,22.86 | K4.1 v33.91,8.89
  Bottom 0.254: K2.20 v33.91,8.89 33.91,12.32 33.53,12.7 29.21,12.7 27.05,14.86 27.05,18.16 25.4,19.81 25.4,21.59 25.02,21.97 24.64,21.97 23.75,22.86 v23.24,22.86
IO5  (via drill 0.41)
  Top 0.254: IC2.34 24.19,24.19 v24.13,24.13
  Top 0.406: v39.75,11.43 K4.19
  Bottom 0.254: v24.13,24.13 24.13,23.24 24.89,22.48 25.27,22.48 25.91,21.84 25.91,20.07 27.56,18.41 27.56,15.75 28.07,15.24 33.91,15.24 34.42,14.73 34.42,11.94 34.92,11.43 K2.17
  Bottom 0.406: K2.17 v39.75,11.43
IO6  (via drill 0.41)
  Top 0.254: IC2.33 25.99,24.09 25.82,24.09 25.78,24.13 v25.78,25.02
  Top 0.406: v39.75,13.97 K4.18
  Bottom 0.254: v39.75,13.97 35.18,13.97 35.05,14.1 35.05,14.86 34.16,15.75 34.16,17.27 33.66,17.78 28.7,17.78 28.32,18.16 28.32,18.67 27.3,19.68 27.3,21.59 25.78,23.11 v25.78,25.02
  Bottom 0.406: K2.15 v39.75,13.97
IO7  (via drill 0.41)  (1 unrouted)
  Top 0.254: IC2.43 16.99,24.49 v16.89,24.38
  Top 0.406: v0.76,31.75 K3.10
  Bottom 0.254: v16.89,24.38 15.49,24.38 15.11,24.38 13.72,25.78 13.72,26.16 13.72,29.97 12.83,30.86 5.97,30.86 5.08,31.75 K3.10
  Bottom 0.406: K1.2 v0.76,31.75
IO8  (via drill 0.41)
  Top 0.254: IC2.32 24.41,23.27 24.13,22.99 24.13,21.72 v23.37,21.72
  Top 0.406: K3.11 v6.86,31.75
  Bottom 0.254: v23.37,21.72 21.46,21.72 20.45,22.73 20.45,23.11 20.45,25.15 20.07,25.53 14.73,25.53 14.22,26.04 14.22,30.48 12.95,31.75 K1.1
  Bottom 0.406: v6.86,31.75 K1.1
LD1
  Top 0.254: IC2.2 13.06,23.27 11.68,24.64 11.68,37.21 12.03,37.55 R4.1
LD2  (via drill 0.41)
  Top 0.254: IC2.3 13.09,22.47 11.18,24.38 v11.18,37.97 | v19.43,38.35 19.39,38.39 R5.1
  Bottom 0.254: v11.18,37.97 11.68,38.48 15.62,38.48 15.75,38.35 v19.43,38.35
LD3  (via drill 0.41)  (1 unrouted)
  Top 0.254: IC2.4 15.95,21.67 v16,21.72
  Bottom 0.254: v16,21.72 17.14,21.72
LD4  (via drill 0.41)  (1 unrouted)
  Top 0.254: IC2.5 16.98,20.87 v17.02,20.83
  Bottom 0.254: v17.02,20.83 17.91,20.83
MCLR  (via drill 0.41)
  Top 0.254: IC2.18 20.99,12.79 v21.21,12.57 21.46,12.57 21.59,12.45 R1.1
  Bottom 0.254: v21.21,12.57 15.62,12.57 15.24,12.19 15.11,12.19 12.83,9.91 12.83,8.38 11.94,7.49 10.03,7.49 7.62,5.08 7.62,1.78 ICSP.1
N$2
  Top 0.254: C5.2 26.04,32.77 26.16,32.89 Q1.1 26.16,32.77 27.69,32.77 28.07,32.38 28.07,22.73 27,21.67 IC2.30
N$3
  Top 0.254: C4.1 26.16,30.73 | 26.16,30.73 Q1.2 | 26.16,30.73 27.3,30.73 27.56,30.48 27.56,22.99 27.04,22.47 IC2.31
N$5
  Top 0.254: LP.A 29.97,4.19 31.62,4.19 R16.1
N$12
  Top 0.406: LED1.A R4.2
N$13
  Top 0.406: LED2.A R5.2
N$14
  Top 0.406: R6.2 LED3.A
N$15
  Top 0.406: LED4.A R7.2
PWMA1  (via drill 0.41)
  Top 0.254: IC2.14 17.79,13.09 17.14,12.45 11.68,12.45 10.79,13.34 10.79,14.86 10.29,15.37 10.29,19.81 10.03,20.07 9.27,20.07 8.95,20.39 K3.15
  Top 0.406: K3.15 v6.86,21.59
  Bottom 0.406: v6.86,21.59 K1.9
PWMA2  (via drill 0.41)  (1 unrouted)
  Top 0.254: IC2.10 15.65,16.87 15.75,16.76 v17.14,16.76
  Top 0.406: v0.76,21.59 K3.6
  Bottom 0.254: v17.14,16.76 13.46,16.76 12.19,18.03 6.35,18.03 5.84,18.54 5.84,21.46 5.71,21.59 K3.6
  Bottom 0.406: K1.10 v0.76,21.59
PWMB1  (via drill 0.41)
  Top 0.254: IC2.15 18.59,13.13 17.4,11.94 11.56,11.94 10.41,13.08 10.41,14.61 9.91,15.11 6.22,15.11 5.97,15.37 5.97,18.16 v6.86,19.05 K1.11 9.4,19.05
  Top 0.406: K3.16 v6.86,19.05
  Bottom 0.406: v6.86,19.05 K1.11 8.89,19.05
PWMB2  (via drill 0.41)  (1 unrouted)
  Top 0.254: IC2.11 16.32,16.07 v16.38,16
  Top 0.406: v0.76,19.05 K3.5
  Bottom 0.254: v16.38,16 13.59,16 12.06,17.53 6.22,17.53 4.7,19.05 K3.5
  Bottom 0.406: K1.12 v0.76,19.05
RX1  (via drill 0.41)  (1 unrouted)
  Top 0.254: IC2.38 20.99,23.33 v21.59,22.99
  Top 0.406: v39.75,24.13 K4.14
  Bottom 0.254: v21.59,22.99 24.38,25.78 27.18,25.78 27.94,25.02 27.94,23.5 28.83,22.61 34.29,22.61 34.92,23.24 36,23.24 K4.14
  Bottom 0.406: K2.7 v39.75,24.13
RX2  (via drill 0.41)
  Top 0.254: IC2.24 27.2,16.87 28.32,15.75 28.32,11.18 29.08,10.41 33.4,10.41 34.04,11.05 34.04,17.53 34.67,18.16 34.67,18.8 34.92,19.05 K4.16
  Top 0.406: K4.16 v39.75,19.05
  Bottom 0.406: v39.75,19.05 K2.11
SCL  (via drill 0.41)
  Top 0.254: 16.13,26.92 16.13,25.93 IC2.44 16.19,26.86 16.13,26.92 | 16.13,26.92 16,27.05 14.1,27.05 13.97,27.18 IC1.6 13.97,31.5 14.35,31.88 v16.38,31.88 18.41,31.88 19.56,33.02 R3.2
  Top 0.406: K4.7 v33.78,24.13
  Bottom 0.254: v33.78,24.13 33.78,26.67 34.42,27.3 34.42,33.4 34.42,36.45 33.66,37.21 30.61,37.21 28.57,37.21 27.81,37.21 27.43,37.59 24,37.59 23.5,37.59 23.11,37.21 22.35,36.45 18.41,36.45 16.89,34.92 | 16.89,35.05 16.89,34.92 | 16.89,34.92 16.89,32.38 v16.38,31.88
  Bottom 0.406: v33.78,24.13 K2.8
SDA  (via drill 0.41)
  Top 0.254: R2.2 v17.91,32.64 13.34,32.64 12.7,32 IC1.5 12.7,24.64 13.27,24.07 IC2.1
  Top 0.406: K4.8 32.89,26.67 33.15,26.92 v33.15,27.69
  Bottom 0.254: v17.91,32.64 17.91,35.31 18.54,35.94 22.61,35.94 23.75,37.08 26.67,37.08 27.18,36.58 33.4,36.58 33.91,36.07 33.91,28.45 v33.15,27.69
  Bottom 0.406: v33.15,27.69 33.15,26.92 32.89,26.67 K2.6
TX1  (via drill 0.41)
  Top 0.254: IC2.37 21.79,24.46 v21.72,24.38 21.72,24.41
  Top 0.406: v39.75,26.67 K4.13
  Bottom 0.254: v21.72,24.38 22.35,24.38 24.13,26.16 27.43,26.16 28.45,25.15 28.45,23.62 28.96,23.11 33.91,23.11 34.67,23.88 34.67,26.29 35.05,26.67 v39.75,26.67
  Bottom 0.406: K2.5 v39.75,26.67
TX2  (via drill 0.41)
  Top 0.254: IC2.23 27.11,16.07 27.69,15.49 27.69,10.92 28.7,9.91 33.78,9.91 34.54,10.67 34.54,16.38 34.67,16.51 K4.17
  Top 0.406: v39.75,16.51 K4.17
  Bottom 0.406: K2.13 v39.75,16.51
VCAP/VDDCORE
  Top 0.254: IC2.7 12.28,19.27 12.19,19.18 C2.1
VENC  (via drill 0.41)  (1 unrouted)
  Top 0.406: K3.9 v0.76,29.21 | v6.86,29.21 K3.12
  Bottom 0.406: v0.76,29.21 K1.4 | K1.3 v6.86,29.21

### Text on the board
tPlace: M2 | M1 | BUS | IO7 | IO8 | 5V | 12V | VENC | GND | 3v | CHA | SDA | TX1 | CHB | SCL | RX1 | PWMA | GND | GND | PWMB | IO0 | RX2 | EN | IO1 | TX2 | GND | IO2 | IO6 | AN A | IO3 | IO5 | AN B | IO4 | GND | GPIO